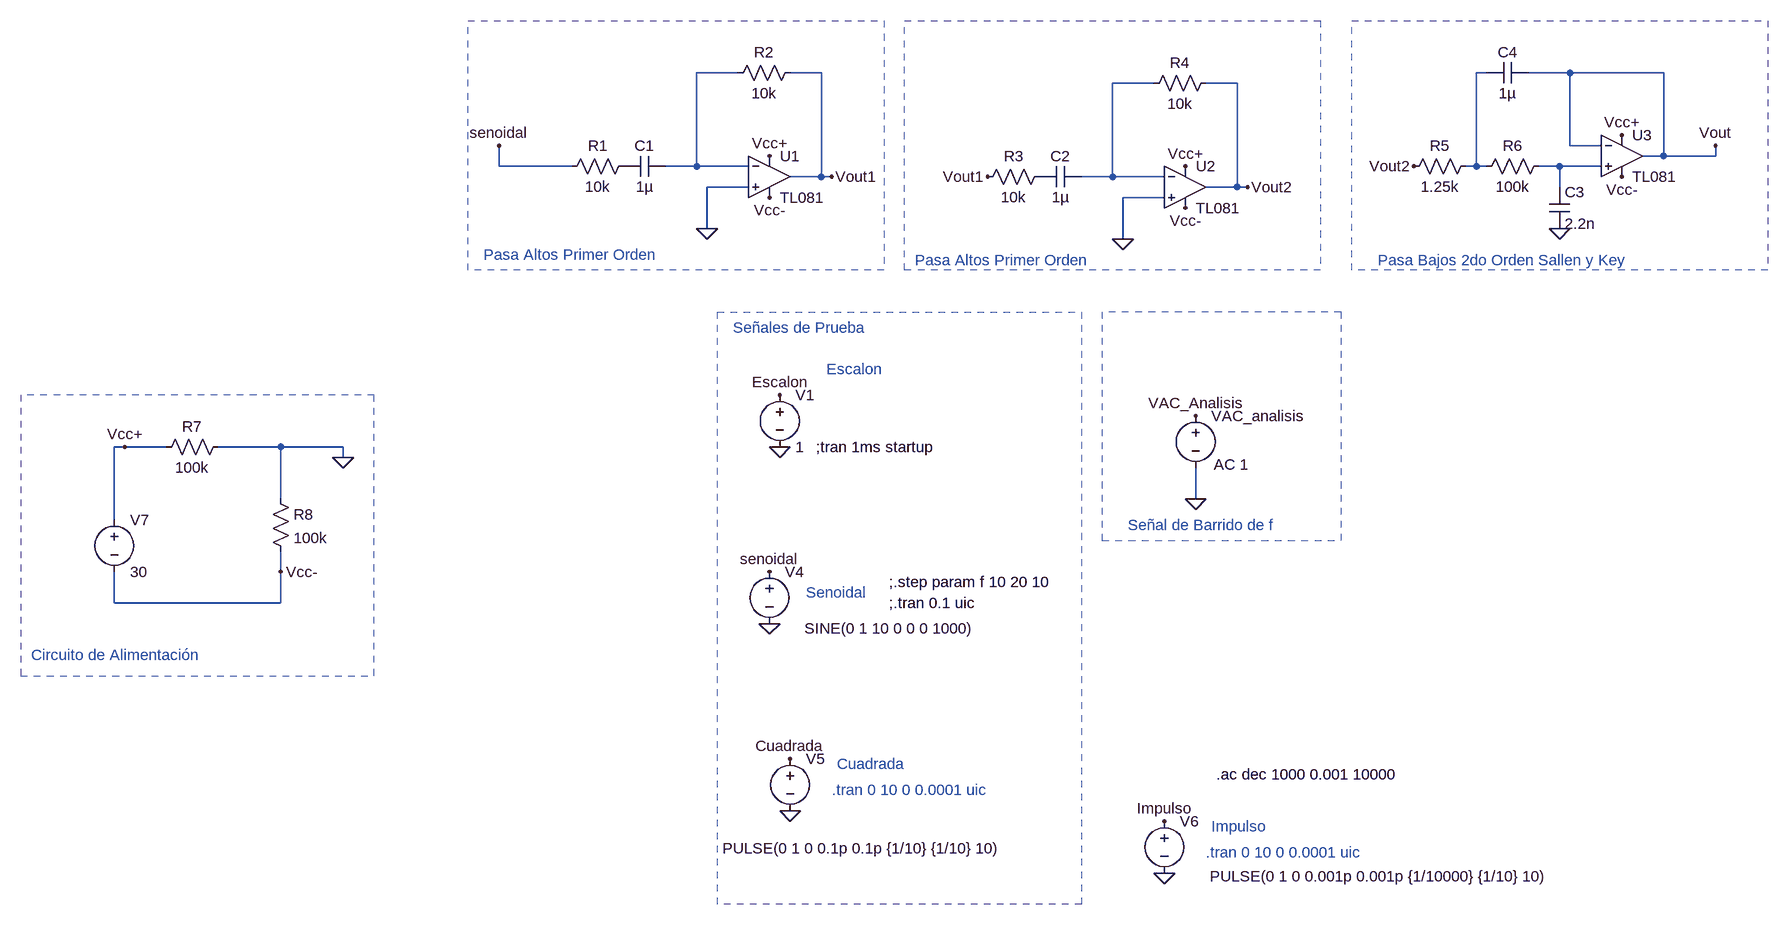
[diagram p0: schematic tp.asc]
tp.asc, the LTspice schematic file:
Version 4.1
SHEET 1 3148 1040
WIRE 256 -400 192 -400
WIRE 384 -400 336 -400
WIRE 1408 -400 1392 -400
WIRE 1536 -400 1472 -400
WIRE 1680 -400 1536 -400
WIRE 896 -384 832 -384
WIRE 1024 -384 976 -384
WIRE 1536 -288 1536 -400
WIRE 1584 -288 1536 -288
WIRE 1680 -272 1680 -400
WIRE 1680 -272 1648 -272
WIRE 1760 -272 1760 -288
WIRE 1760 -272 1680 -272
WIRE -112 -256 -112 -288
WIRE 0 -256 -112 -256
WIRE 192 -256 192 -400
WIRE 192 -256 144 -256
WIRE 272 -256 192 -256
WIRE 1392 -256 1392 -400
WIRE 1392 -256 1376 -256
WIRE 1408 -256 1392 -256
WIRE 1520 -256 1488 -256
WIRE 1584 -256 1520 -256
WIRE 384 -240 384 -400
WIRE 384 -240 336 -240
WIRE 400 -240 384 -240
WIRE 832 -240 832 -384
WIRE 832 -240 784 -240
WIRE 912 -240 832 -240
WIRE 272 -224 208 -224
WIRE 1024 -224 1024 -384
WIRE 1024 -224 976 -224
WIRE 1040 -224 1024 -224
WIRE 1520 -224 1520 -256
WIRE 912 -208 848 -208
WIRE 208 -160 208 -224
WIRE 848 -144 848 -208
WIRE -688 176 -704 176
WIRE -624 176 -688 176
WIRE -448 176 -544 176
WIRE -352 176 -448 176
WIRE -352 192 -352 176
WIRE -448 256 -448 176
WIRE 960 256 960 208
WIRE -704 288 -704 176
WIRE -448 368 -448 336
WIRE -704 416 -704 368
WIRE -448 416 -448 368
WIRE -448 416 -704 416
FLAG 960 256 0
FLAG 400 -240 Vout1
FLAG 336 736 0
FLAG 304 448 0
FLAG 320 176 0
FLAG 208 -160 0
FLAG 1520 -160 0
FLAG 1296 -256 Vout2
FLAG 320 96 Escalon
FLAG 304 368 senoidal
FLAG 336 656 Cuadrada
FLAG 1760 -288 Vout
FLAG 960 128 VAC_Analisis
FLAG 912 832 0
FLAG 912 752 Impulso
FLAG 1040 -224 Vout2
FLAG 848 -144 0
FLAG 640 -240 Vout1
FLAG -352 192 0
FLAG -688 176 Vcc+
FLAG 304 -208 Vcc-
FLAG 304 -272 Vcc+
FLAG 944 -256 Vcc+
FLAG 944 -192 Vcc-
FLAG 1616 -304 Vcc+
FLAG 1616 -240 Vcc-
FLAG -448 368 Vcc-
FLAG -112 -288 senoidal
SYMBOL voltage 320 80 R0
WINDOW 123 0 0 Left 0
WINDOW 39 0 0 Left 0
SYMATTR InstName V1
SYMATTR Value 1
SYMBOL res 96 -272 R90
WINDOW 0 0 56 VBottom 2
WINDOW 3 32 56 VTop 2
SYMATTR InstName R1
SYMATTR Value 10k
SYMBOL voltage 304 352 R0
WINDOW 3 54 103 Left 2
WINDOW 123 0 0 Left 0
WINDOW 39 0 0 Left 0
SYMATTR Value SINE(0 1 10 0 0 0 1000)
SYMATTR InstName V4
SYMBOL voltage 336 640 R0
WINDOW 123 0 0 Left 0
WINDOW 39 0 0 Left 0
WINDOW 3 -104 154 Left 2
SYMATTR Value PULSE(0 1 0 0.1p 0.1p {1/10} {1/10} 10)
SYMATTR InstName V5
SYMBOL voltage 960 112 R0
WINDOW 123 28 91 Left 2
WINDOW 39 0 0 Left 0
SYMATTR Value2 AC 1
SYMATTR InstName VAC_analisis
SYMATTR Value ""
SYMBOL OpAmps\\TL081 304 -240 R0
SYMATTR InstName U1
SYMBOL cap 144 -272 R90
WINDOW 0 0 32 VBottom 2
WINDOW 3 32 32 VTop 2
SYMATTR InstName C1
SYMATTR Value 1µ
SYMBOL res 352 -416 R90
WINDOW 0 0 56 VBottom 2
WINDOW 3 32 56 VTop 2
SYMATTR InstName R2
SYMATTR Value 10k
SYMBOL OpAmps\\TL081 1616 -272 R0
SYMATTR InstName U3
SYMBOL res 1392 -272 R90
WINDOW 0 0 56 VBottom 2
WINDOW 3 32 56 VTop 2
SYMATTR InstName R5
SYMATTR Value 1.25k
SYMBOL res 1504 -272 R90
WINDOW 0 0 56 VBottom 2
WINDOW 3 32 56 VTop 2
SYMATTR InstName R6
SYMATTR Value 100k
SYMBOL cap 1504 -224 R0
SYMATTR InstName C3
SYMATTR Value 2.2n
SYMBOL cap 1472 -416 R90
WINDOW 0 0 32 VBottom 2
WINDOW 3 32 32 VTop 2
SYMATTR InstName C4
SYMATTR Value 1µ
SYMBOL voltage 912 736 R0
WINDOW 123 0 0 Left 0
WINDOW 39 0 0 Left 0
WINDOW 3 70 101 Left 2
SYMATTR Value PULSE(0 1 0 0.001p 0.001p {1/10000} {1/10} 10)
SYMATTR InstName V6
SYMBOL res 736 -256 R90
WINDOW 0 0 56 VBottom 2
WINDOW 3 32 56 VTop 2
SYMATTR InstName R3
SYMATTR Value 10k
SYMBOL OpAmps\\TL081 944 -224 R0
SYMATTR InstName U2
SYMBOL cap 784 -256 R90
WINDOW 0 0 32 VBottom 2
WINDOW 3 32 32 VTop 2
SYMATTR InstName C2
SYMATTR Value 1µ
SYMBOL res 992 -400 R90
WINDOW 0 0 56 VBottom 2
WINDOW 3 32 56 VTop 2
SYMATTR InstName R4
SYMATTR Value 10k
SYMBOL voltage -704 272 R0
WINDOW 123 0 0 Left 0
WINDOW 39 0 0 Left 0
SYMATTR InstName V7
SYMATTR Value 30
SYMBOL res -528 160 R90
WINDOW 0 0 56 VBottom 2
WINDOW 3 32 56 VTop 2
SYMATTR InstName R7
SYMATTR Value 100k
SYMBOL res -464 240 R0
SYMATTR InstName R8
SYMATTR Value 100k
TEXT 376 176 Left 2 !;tran 1ms startup
TEXT 392 56 Left 2 ;Escalon
TEXT 488 416 Left 2 !;.tran 0.1 uic
TEXT 488 384 Left 2 !;.step param f 10 20 10
TEXT 360 400 Left 2 ;Senoidal
TEXT 400 704 Left 2 ;.tran 0 10 0 0.0001 uic
TEXT 408 664 Left 2 ;Cuadrada
TEXT 976 800 Left 2 ;.tran 0 10 0 0.0001 uic
TEXT 984 760 Left 2 ;Impulso
TEXT 992 680 Left 2 !.ac dec 1000 0.001 10000
TEXT -832 496 Left 2 ;Circuito de Alimentación
TEXT -136 -120 Left 2 ;Pasa Altos Primer Orden
TEXT 528 -112 Left 2 ;Pasa Altos Primer Orden
TEXT 1240 -112 Left 2 ;Pasa Bajos 2do Orden Sallen y Key
TEXT 248 -8 Left 2 ;Señales de Prueba
TEXT 856 296 Left 2 ;Señal de Barrido de f
RECTANGLE Normal -160 -480 480 -96 2
RECTANGLE Normal 512 -480 1152 -96 2
RECTANGLE Normal 1200 -480 1840 -96 2
RECTANGLE Normal 224 -32 784 880 2
RECTANGLE Normal 816 320 1184 -32 2
RECTANGLE Normal -304 96 -848 528 2

The netlist it stands for:
* tp.asc
V1 Escalon 0 1
R1 P001 senoidal 10k
V4 senoidal 0 SINE(0 1 10 0 0 0 1000)
V5 Cuadrada 0 PULSE(0 1 0 0.1p 0.1p {1/10} {1/10} 10)
VAC_analisis VAC_Analisis 0 AC 1
* U1: TL081 (symbol OpAmps\TL081 not available, pins judged from their places): In+=0 In-=N001 V+=Vcc+ V-=Vcc- OUT=Vout1
C1 N001 P001 1µ
R2 Vout1 N001 10k
* U3: TL081 (symbol OpAmps\TL081 not available, pins judged from their places): In+=N004 In-=Vout V+=Vcc+ V-=Vcc- OUT=Vout
R5 N002 Vout2 1.25k
R6 N004 N002 100k
C3 N004 0 2.2n
C4 Vout N002 1µ
V6 Impulso 0 PULSE(0 1 0 0.001p 0.001p {1/10000} {1/10} 10)
R3 P002 Vout1 10k
* U2: TL081 (symbol OpAmps\TL081 not available, pins judged from their places): In+=0 In-=N003 V+=Vcc+ V-=Vcc- OUT=Vout2
C2 N003 P002 1µ
R4 Vout2 N003 10k
V7 Vcc+ Vcc- 30
R7 0 Vcc+ 100k
R8 0 Vcc- 100k
;tran 1ms startup
* Escalon
;.tran 0.1 uic
;.step param f 10 20 10
* Senoidal
* .tran 0 10 0 0.0001 uic
* Cuadrada
* .tran 0 10 0 0.0001 uic
* Impulso
.ac dec 1000 0.001 10000
* Circuito de Alimentación
* Pasa Altos Primer Orden
* Pasa Altos Primer Orden
* Pasa Bajos 2do Orden Sallen y Key
* Señales de Prueba
* Señal de Barrido de f
.backanno
.end